# EasyEDA Pro project ProPrj_1111_2025-11-28.epro

# Schematic Schematic1
Board Name: Board1; Create Date: 2025-11-28; Page Name: P1; Project Name: 1111; Schematic Name: Schematic1; Update Date: 2025-11-28; Company: 嘉立创EDA; Page Size: A4; Version: V1.0
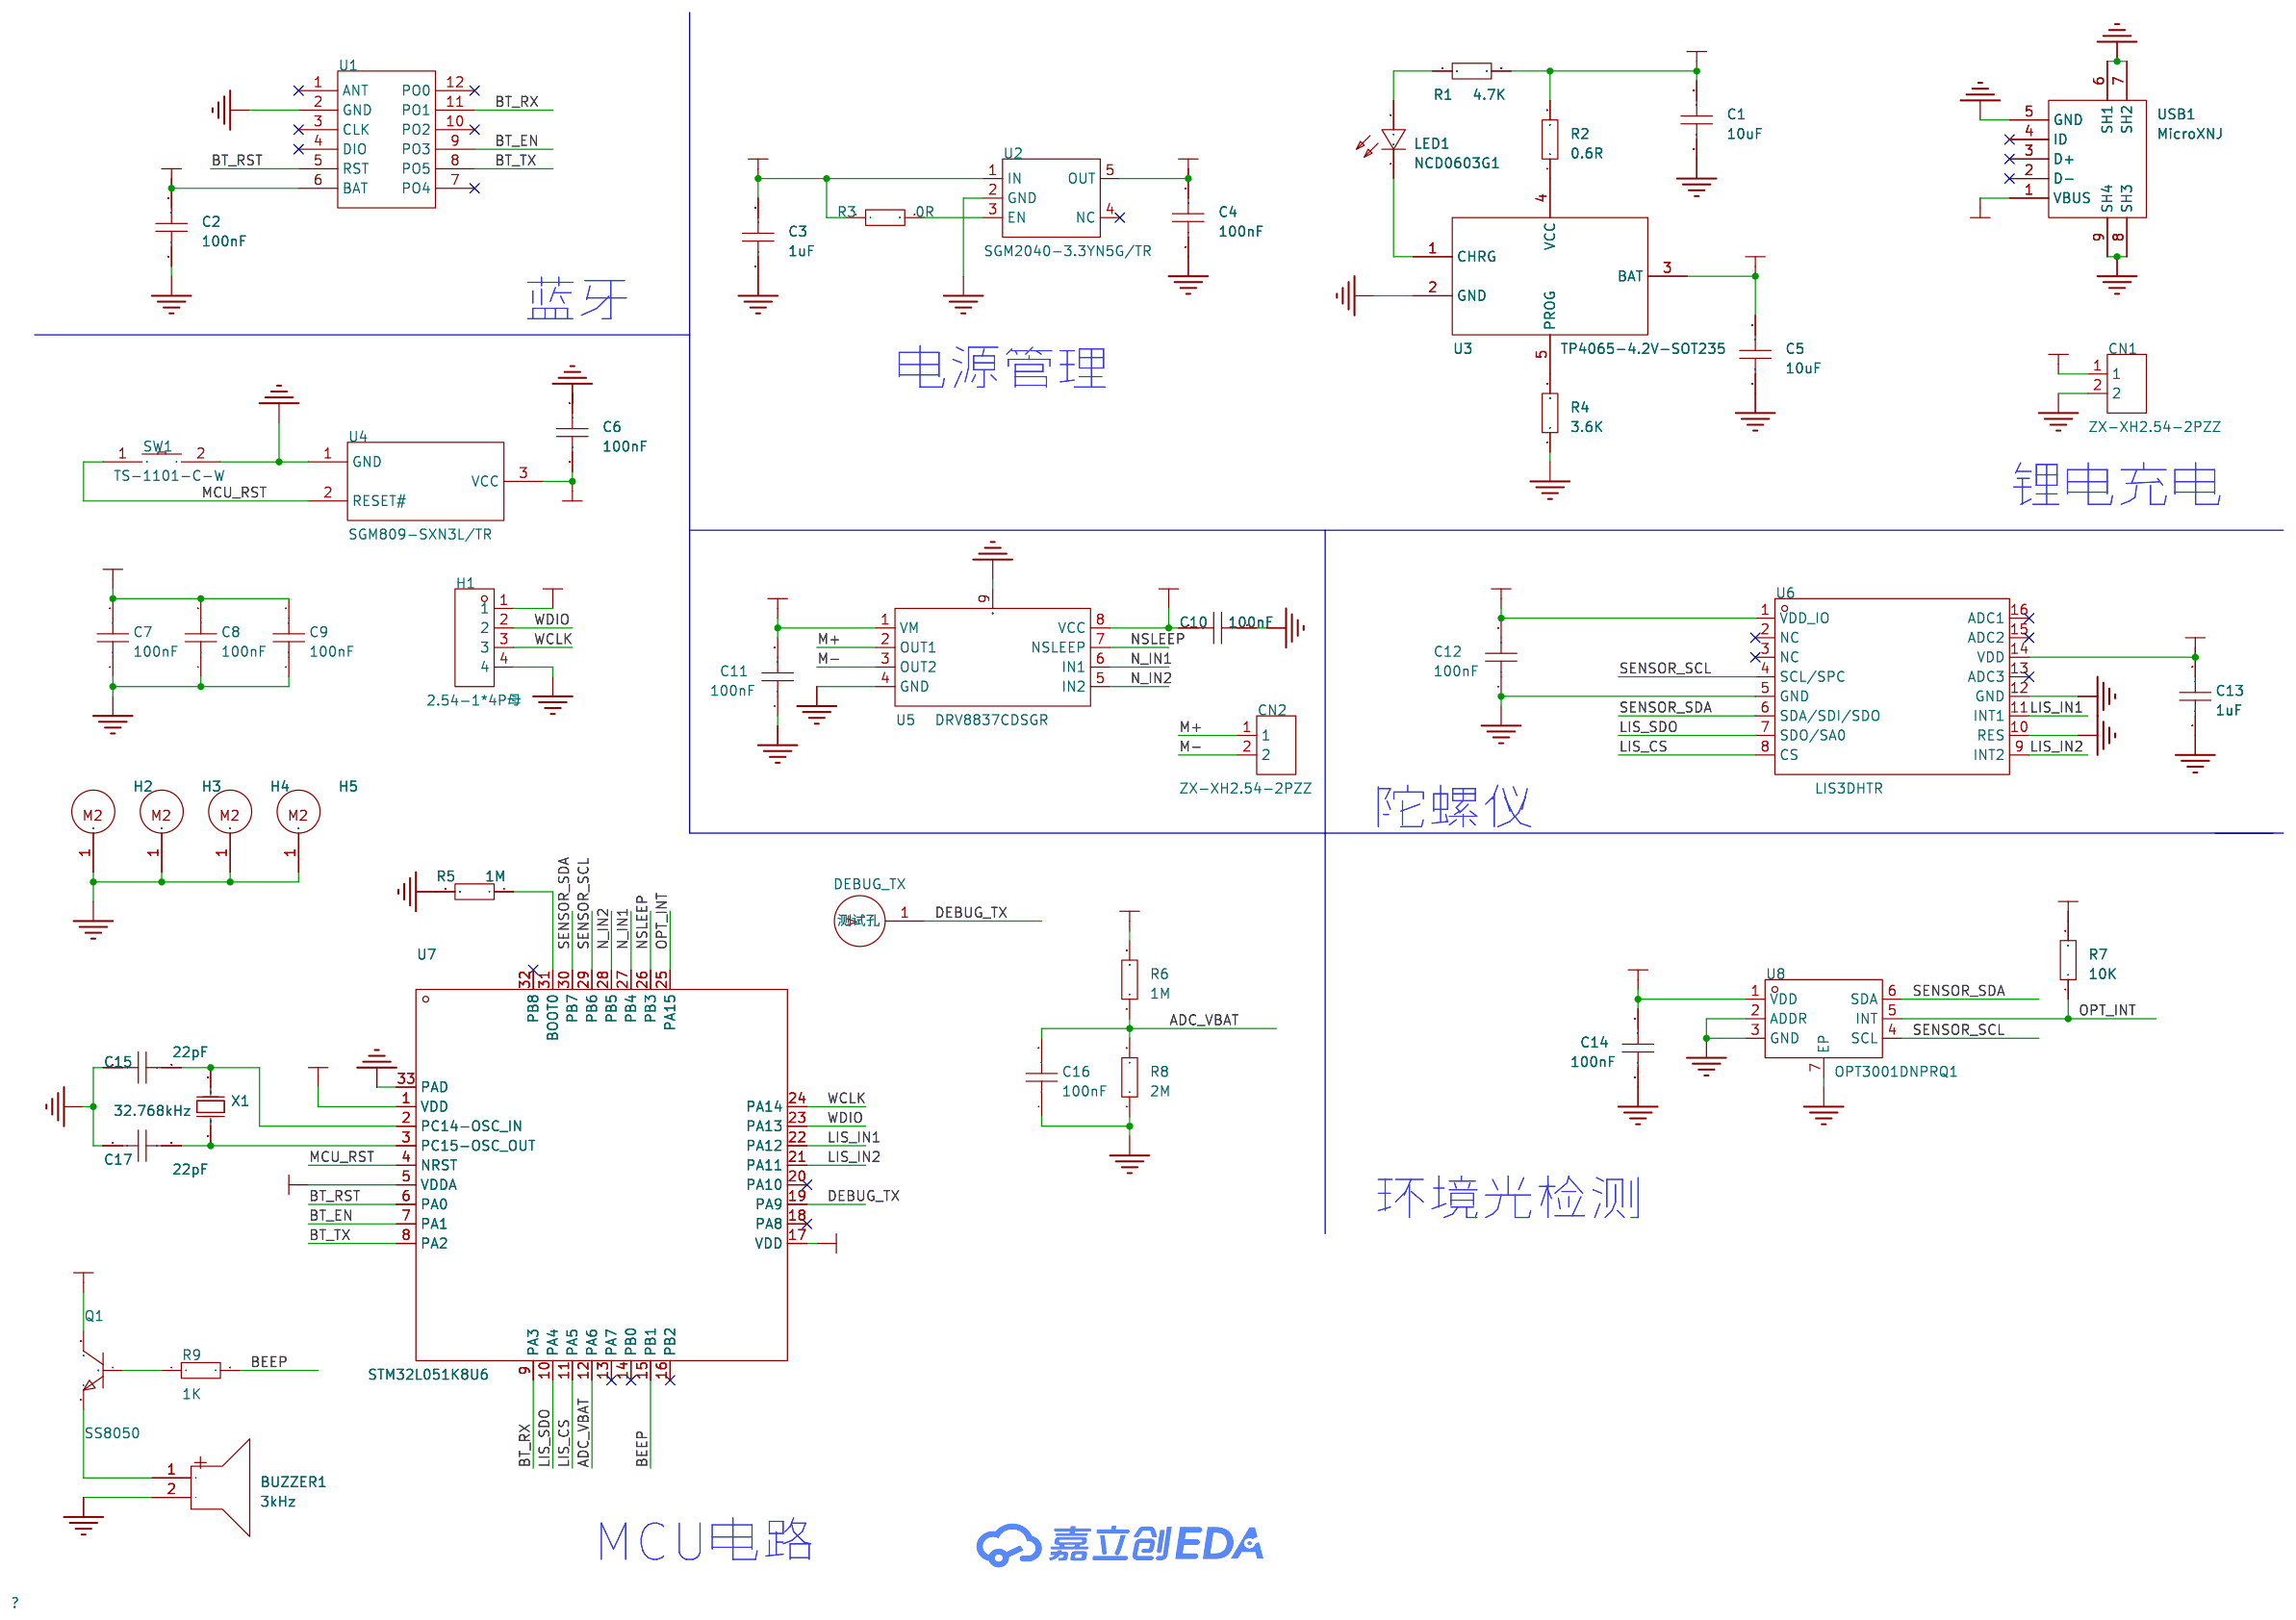
[diagram p0: schematic sheet]

## Parts
BUZZER1  3kHz  [BUZ-TH_BD9.0-P5.00-D0.6-FD]
C1  10uF  [C0603]
C2  100nF  [C0603]
C3  1uF  [C0603]
C4  100nF  [C0603]
C5  10uF  [C0603]
C6  100nF  [C0603]
C7  100nF  [C0603]
C8  100nF  [C0603]
C9  100nF  [C0603]
C10  100nF  [C0603]
C11  100nF  [C0603]
C12  100nF  [C0603]
C13  1uF  [C0603]
C14  100nF  [C0603]
C15  22pF  [C0603]
C16  100nF  [C0603]
C17  22pF  [C0603]
CN1  ZX-XH2.54-2PZZ  [CONN-TH_2P-P2.50_HX25003-2A]
CN2  ZX-XH2.54-2PZZ  [CONN-TH_2P-P2.50_HX25003-2A]
DEBUG_TX  -  [测试孔]
H1  2.54-1*4P母  [HDR-TH_4P-P2.54-V-F]
H2  -  [M2螺丝孔]
H3  -  [M2螺丝孔]
H4  -  [M2螺丝孔]
H5  -  [M2螺丝孔]
LED1  NCD0603G1  [LED0603-RD_1]
Q1  SS8050  [SOT-23_L2.9-W1.3-P1.90-LS2.4-BR]
R1  4.7K  [R0603]
R2  0.6R  [R0603]
R3  0R  [R0603]
R4  3.6K  [R0603]
R5  1M  [R0603]
R6  1M  [R0603]
R7  10K  [R0603]
R8  2M  [R0603]
R9  1K  [R0603]
SW1  TS-1101-C-W  [SW-SMD_L6.0-W3.3-LS8.0]
U1  -  [pw02]
U2  SGM2040-3.3YN5G/TR  [SOT-23-5_L2.9-W1.6-P0.95-LS2.8-BL]
U3  TP4065-4.2V-SOT235  [SOT-23-5_L3.0-W1.7-P0.95-LS2.8-BR]
U4  SGM809-SXN3L/TR  [SOT-23-3_L2.9-W1.6-P1.90-LS2.8-BR]
U5  DRV8837CDSGR  [WSON-8_L2.0-W2.0-P0.50-TL-EP]
U6  LIS3DHTR  [LGA-16_L3.0-W3.0-P0.50-TL]
U7  STM32L051K8U6  [UFQFPN-32_L5.0-W5.0-P0.50-BL-EP]
U8  OPT3001DNPRQ1  [TDFN-6_L2.0-W2.0-P0.65-TL-EP1.4]
USB1  MicroXNJ  [MICRO-USB-SMD_MICROXNJ]
X1  32.768kHz  [CRYSTAL-SMD_L3.2-W1.5-1]

## Library data of the parts
BUZZER1 = HNB09A03: 驱动方式:有源(内含驱动线路);构造类型:电磁式;频率:3kHz;声压(SPL):85dB;; LCSC Part Name: 电磁式有源一体蜂鸣器HNB09A03; Supplier Part: C96102; Manufacturer: 华能; Supplier Footprint: 插件,D=9mm; JLCPCB Part Class: 扩展库; Datasheet: https://item.szlcsc.com/datasheet/HNB09A03/97306.html; Supplier: LCSC; Driver Circuitry: 有源(内含驱动线路); Technology: 电磁式; Voltage - Supply: 1.5V~4.5V; Current Consumption: 30mA; Sound Pressure Level(SPL): 85dB; Diameter(φD): 9mm; Height: 5.5mm; Operating Temperature: -20℃~+70℃
C1-C17 = CAP_0603: Supplier Footprint: 0603
CN1 CN2 = ZX-XH2.54-2PZZ: 插针结构:1x2P;间距:2.5mm;安装方式:直插;参考系列:XH;总PIN数:2P;排数:1;每排PIN数:2;行距:-;额定电流:2A;触头材质:黄铜;触头镀层:锡;工作温度:-25℃~+85℃;; LCSC Part Name: 1x2P 间距:2.5mm 直插 系列:XH; Supplier Part: C7429632; Manufacturer: Megastar(兆星); Supplier Footprint: 插件,P=2.5mm; Datasheet: https://item.szlcsc.com/datasheet/ZX-XH2.54-2PZZ/8427549.html; Supplier: LCSC; Pins Structure: 1x2P; Pitch: 2.5mm; Mounting Type: 直插; Reference Series: XH; Number of Pins: 2P; Number of Rows: 1; Number of PINs Per Row: 2; Current Rating: 2A; Contact Material: 黄铜; Contact Plating: 锡; Operating Temperature: -25℃~+85℃; Voltage Rating: 250V; Plastic Material: PA66; Flame Retardant Rating: UL94V-0; Color: 白色; Z-Height of the Board: 7mm; X-Length of Bottom Edge on Board (Spacing Line): 7.5mm; Y-Width of Bottom Edge on Board: 5.9mm
DEBUG_TX = 测试孔
H1 = 2.54-1*4P母: 插孔结构:1x4P;间距:2.54mm;行距:-;圆孔/方孔:方孔;安装方式:直插;排数:单排;总孔位数:4P;额定电流:3A;额定电压:-;插孔方向:顶部;塑高:-;触头材质:青铜;触头镀层:-;工作温度:-40℃~+105℃;; LCSC Part Name: 间距:2.54mm 1x4P 直插; Supplier Part: C2718488; Manufacturer: BOOMELE(博穆精密); Supplier Footprint: 插件,P=2.54mm; JLCPCB Part Class: 扩展库; Datasheet: https://item.szlcsc.com/datasheet/2.54-1*4P%25E6%25AF%258D/2834502.html; Supplier: LCSC; Holes Structure: 1x4P; Pitch: 2.54mm; Circular Hole / Square Hole: 方孔; Mounting Type: 直插; Number of Rows: 单排; Number of Positions: 4P; Current Rating: 3A; Holes Direction: 顶部; Contact Material: 青铜; Operating Temperature: -40℃~+105℃
H2-H5 = M2螺丝孔
LED1 = NCD0603G1: 发光颜色:翠绿色;正向压降(Vf):2.6V~3.6V;功率:72mW;正向电流:20mA;波长:515nm~530nm;透镜颜色:-;发光强度:330mcd~900mcd;发光角度:130°;工作温度:-30℃~+85℃;; Supplier Part: C84267; Manufacturer: 国星光电; Supplier Footprint: 0603; JLCPCB Part Class: 扩展库; Datasheet: https://item.szlcsc.com/datasheet/NCD0603G1/85436.html; Supplier: LCSC; Illumination Color: 翠绿色; Voltage - Forward(Vf): 2.6V~3.6V; Power(Watts): 72mW; Forward Current: 20mA; Wavelength - Dominant: 515nm~530nm; Luminous Intensity: 330mcd~900mcd; Viewing Angle: 130°; Operating Temperature: -30℃~+85℃
Q1 = SS8050_C431710: 晶体管类型:NPN;集电极电流(Ic):1.5A;集射极击穿电压(Vceo):25V;功率(Pd):300mW;直流电流增益(hFE@Ic,Vce):120@100mA,1V;; LCSC Part Name: NPN 电流:1.5A 耐压:25V (200-350); Supplier Part: C431710; Manufacturer: MDD(辰达半导体); Supplier Footprint: SOT-23; JLCPCB Part Class: 扩展库; Datasheet: https://atta.szlcsc.com/upload/public/pdf/source/20240710/2275D45831FEB988B7478BE0F5F4041C.pdf; Supplier: LCSC; Transistor Type: NPN; Collector Current (Ic): 1.5A; Collector-Emitter Breakdown Voltage (Vceo): 25V; Power Dissipation (Pd): 300mW; DC Current Gain (hFE@Ic,Vce): 120@100mA,1V; Transition Frequency (fT): 100MHz; Collector Cut-Off Current (Icbo): 100nA; Collector-Emitter Saturation Voltage (VCE(sat)@Ic,Ib): 500mV@800mA,80mA; Operating Temperature: -55℃~+150℃
R1-R9 = Res_0603: Supplier Footprint: 0603
SW1 = TS-1101-C-W: 电路结构:单刀单掷;按钮形状:矩形按钮;作用力:260gf;安装方式:立贴;开关长度:6mm;开关宽度:3.6mm;开关高度:2.5mm;带支架:不带;触点电流:50mA;额定电压(AC):-;额定电压(DC):12V;额定功率:-;绝缘电阻:-;带灯:无;机械寿命:5万次;; LCSC Part Name: 6*3.6*2.5mm 立贴 轻触开关; Supplier Part: C318938; Manufacturer: XKB Connectivity(中国星坤); Supplier Footprint: SMD; Datasheet: https://atta.szlcsc.com/upload/public/pdf/source/20200227/C318938_C2E53B1EEDE37D980A33616AC086DE53.pdf; Supplier: LCSC; Circuit: 单刀单掷; Actuator Style: 矩形按钮; Operating Force: 260gf; Mounting Style: 立贴; Switch Length: 6mm; Switch Width: 3.6mm; Switch Height: 2.5mm; Strike Gundam: 不带; Contact Current: 50mA; Voltage Rating (DC): 12V; Actuator/Cap Color: 白色带淡绿; With Lamp: 无; Mechanical Life: 5万次; Operating Temperature: -30℃~+85℃
U1 = pw02
U2 = SGM2040-3.3YN5G/TR: Supplier Part: C2890487; Manufacturer: SGMICRO(圣邦微); Supplier Footprint: SOT-23-5; JLCPCB Part Class: 扩展库; Datasheet: https://atta.szlcsc.com/upload/public/pdf/source/20241203/03403EB46B615BEBA13221F80CD68D6B.pdf; Supplier: LCSC
U3 = TP4065-4.2V-SOT235: 3mA-600mA 线性锂离子电池充电器; Supplier Part: C113540; Manufacturer: TOPPOWER(南京拓微); Supplier Footprint: SOT-23-5; JLCPCB Part Class: 扩展库; Datasheet: https://atta.szlcsc.com/upload/public/pdf/source/20170601/1496302453692.pdf; Supplier: LCSC
U4 = SGM809-SXN3L/TR: 工作电压:1.2V~5.5V;复位有效电平:低电平有效;受监控电压数:1;复位超时:240ms;; Supplier Part: C49651; Manufacturer: SGMICRO(圣邦微); Supplier Footprint: SOT-23; JLCPCB Part Class: 扩展库; Datasheet: https://item.szlcsc.com/datasheet/SGM809-SXN3L%252FTR/50659.html; Supplier: LCSC; ChipType: 电压监控器; Output Type: 推挽; Voltage - Supply: 1.2V~5.5V; Reset Active Level: 低电平有效; Threshold Voltage: 2.93V; Number of Voltages Monitored: 1; Manual Reset: 无; Watchdog: 无; Reset Timeout: 240ms; Operating Temperature: -40℃~+125℃@(Tj); Quiescent Current: 13uA
U5 = DRV8837CDSGR: DRV8837C 12V、1A H 桥电机驱动器; LCSC Part Name: 1A 有刷直流电机驱动芯片 7V; Supplier Part: C191000; Manufacturer: TI(德州仪器); Supplier Footprint: WSON-8-EP(2x2); JLCPCB Part Class: 扩展库; Datasheet: https://www.ti.com/cn/lit/gpn/drv8837c; Supplier: LCSC; RDS(on): 1Ω; Operating Temperature: -40℃~+85℃
U6 = LIS3DHTR: 3轴MEMS加速度计，超低功耗，±2g/±4g/±8g/±16g满量程，高速I2C/SPI数字输出，内置FIFO和高性能加速度传感器，LLGA 16 3x3x1.0封装; Supplier Part: C15134; Manufacturer: ST(意法半导体); Supplier Footprint: LGA-16(3x3); JLCPCB Part Class: 扩展库; Datasheet: https://item.szlcsc.com/datasheet/LIS3DHTR/15808.html; Supplier: LCSC; Voltage - Supply: 1.71V~3.6V; Operating Temperature: -40℃~+85℃
U7 = STM32L051K8U6: CPU内核:ARM-M系列;CPU最大主频:32MHz;应用领域:-;; LCSC Part Name: 基于 ARM Cortex-M0+ 的超低功耗 32 位 MCU，高达 64 KB Flash、8 KB SRAM、2 KB EEPROM、ADC; Supplier Part: C94770; Manufacturer: ST(意法半导体); Supplier Footprint: UFQFPN-32(5x5); JLCPCB Part Class: 扩展库; Datasheet: https://item.szlcsc.com/datasheet/STM32L051K8U6/95970.html; Supplier: LCSC; CPU Core: ARM-M系列; CPU Maximum Speed: 32MHz; Program Storage Size: 64KB; Program Memory Type: FLASH; Number of I/O: 27; ADC (Bit): 12bit; Voltage - Supply: 1.65V~3.6V
U8 = OPT3001DNPRQ1: OPT3001-Q1 具有高精度人眼响应功能的汽车数字环境光传感器 (ALS); Supplier Part: C2876782; Manufacturer: TI(德州仪器); Supplier Footprint: USON-6-EP(2.1x2.1); JLCPCB Part Class: 扩展库; Datasheet: https://www.ti.com/cn/lit/gpn/opt3001-q1; Supplier: LCSC
USB1 = MicroXNJ: 连接器类型:Micro-B;协议标准:USB 2.0;公母:母;安装方式:卧贴;触点数量:5P;端口数量:1;额定电流 - 电源:1.8A;工作温度:-20℃~+85℃;; LCSC Part Name: Micro-B 母 卧贴; Supplier Part: C404969; Manufacturer: SHOU HAN(首韩); Supplier Footprint: SMD; JLCPCB Part Class: 扩展库; Datasheet: https://item.szlcsc.com/datasheet/MicroXNJ/392534.html; Supplier: LCSC; Connector Type: Micro-B; Protocol Standard: USB 2.0; Gender: 母; Mounting Type: 卧贴; Number of Contacts: 5P; Number of Ports: 1; Current Rating-Power: 1.8A; Voltage Rating: 30V; Connect-Disconnect Life: 5千次; Detection color: 黑色; Operating Temperature: -20℃~+85℃
X1 = XKXGI-SUA-32.768K: 晶振类型:贴片晶振;频率:32.768kHz;常温频差:±20ppm;负载电容:12.5pF;频率稳定度:±30ppm;; LCSC Part Name: YST310S 32.768KHZ 2P 3215 12.5PF ±20PPM -40~85℃; Supplier Part: C5213671; Manufacturer: YXC(扬兴晶振); Supplier Footprint: SMD3215-2P; JLCPCB Part Class: 扩展库; Datasheet: https://item.szlcsc.com/datasheet/XKXGI-SUA-32.768K/5908943.html; Supplier: LCSC; Type: 贴片晶振; Normal temperature Frequency Tolerance: ±20ppm; Load Capacitance: 12.5pF; Frequency Stability: ±30ppm; Operating Temperature: -40℃~+85℃

## Nets
GND: BUZZER1.2(-) C1.1 C2.1 C3.1 C4.1 C5.1 C6.1 C7.1 C8.1 C9.1 C10.1 C11.1 C12.1 C13.1 C14.1 C15.1 C16.1 C17.1 CN1.2 H1.4 H2.1 H3.1 H4.1 H5.1 R4.1 R5.2 R8.1 SW1.2 U1.2(GND) U2.2(GND) U3.2(GND) U4.1(GND) U5.4(GND) U5.9(PAD) U6.5(GND) U6.10(RES) U6.12(GND) U7.33(PAD) U8.2(ADDR) U8.3(GND) U8.7(EP) USB1.5(GND) USB1.6(SH1) USB1.7(SH2) USB1.8(SH3) USB1.9(SH4)
VBAT: C3.2 C5.2 C11.2 CN1.1 R3.1 R6.2 U2.1(IN) U3.3(BAT) U5.1(VM)
ADC_VBAT: C16.2 R6.1 R8.2 U7.12(PA6)
BEEP: R9.2 U7.15(PB1)
BT_EN: U1.9(PO3) U7.7(PA1)
BT_RST: U1.5(RST) U7.6(PA0)
BT_RX: U1.11(PO1) U7.9(PA3)
BT_TX: U1.8(PO5) U7.8(PA2)
DC3.3V: C2.2 C4.2 C6.2 C7.2 C8.2 C9.2 C10.2 C12.2 C13.2 C14.2 H1.1 Q1.3(C) R7.2 U1.6(BAT) U2.5(OUT) U4.3(VCC) U5.8(VCC) U6.1(VDD_IO) U6.14(VDD) U7.1(VDD) U7.5(VDDA) U7.17(VDD) U8.1(VDD)
DEBUG_TX: DEBUG_TX.1(测试孔) U7.19(PA9)
LIS_CS: U6.8(CS) U7.11(PA5)
LIS_IN1: U6.11(INT1) U7.22(PA12)
LIS_IN2: U6.9(INT2) U7.21(PA11)
LIS_SDO: U6.7(SDO/SA0) U7.10(PA4)
M+: CN2.1 U5.2(OUT1)
M-: CN2.2 U5.3(OUT2)
MCU_RST: SW1.1 U4.2(RESET#) U7.4(NRST)
N_IN1: U5.6(IN1) U7.27(PB4)
N_IN2: U5.5(IN2) U7.28(PB5)
NSLEEP: U5.7(NSLEEP) U7.26(PB3)
OPT_INT: R7.1 U7.25(PA15) U8.5(INT)
SENSOR_SCL: U6.4(SCL/SPC) U7.29(PB6) U8.4(SCL)
SENSOR_SDA: U6.6(SDA/SDI/SDO) U7.30(PB7) U8.6(SDA)
VUSB: C1.2 R1.1 R2.2 USB1.1(VBUS)
WCLK: H1.3 U7.24(PA14)
WDIO: H1.2 U7.23(PA13)
$1N344: R3.2 U2.3(EN)
$1N805: LED1.1(K) U3.1(CHRG)
$1N852: R4.2 U3.5(PROG)
$1N911: R2.1 U3.4(VCC)
$1N931: LED1.2(A) R1.2
$1N1941: C15.2 U7.2(PC14-OSC_IN) X1.2(OSC2)
$1N1945: C17.2 U7.3(PC15-OSC_OUT) X1.1(OSC1)
$1N2245: R5.1 U7.31(BOOT0)
$1N2484: Q1.1(B) R9.1
$1N2488: BUZZER1.1(+) Q1.2(E)

Not connected (* = marked no-connect by the designer): U1 1(ANT)* 3(CLK)* 4(DIO)* 7(PO4)* 10(PO2)* 12(PO0)*; U2 4(NC)*; U6 2(NC)* 3(NC)* 13(ADC3)* 15(ADC2)* 16(ADC1)*; U7 13(PA7)* 14(PB0)* 16(PB2)* 18(PA8)* 20(PA10)* 32(PB8)*; USB1 2(D-)* 3(D+)* 4(ID)*

## Notes on the sheet
- 蓝牙
- 电源管理
- 锂电充电
- 陀螺仪
- 环境光检测
- MCU电路

# Board PCB1
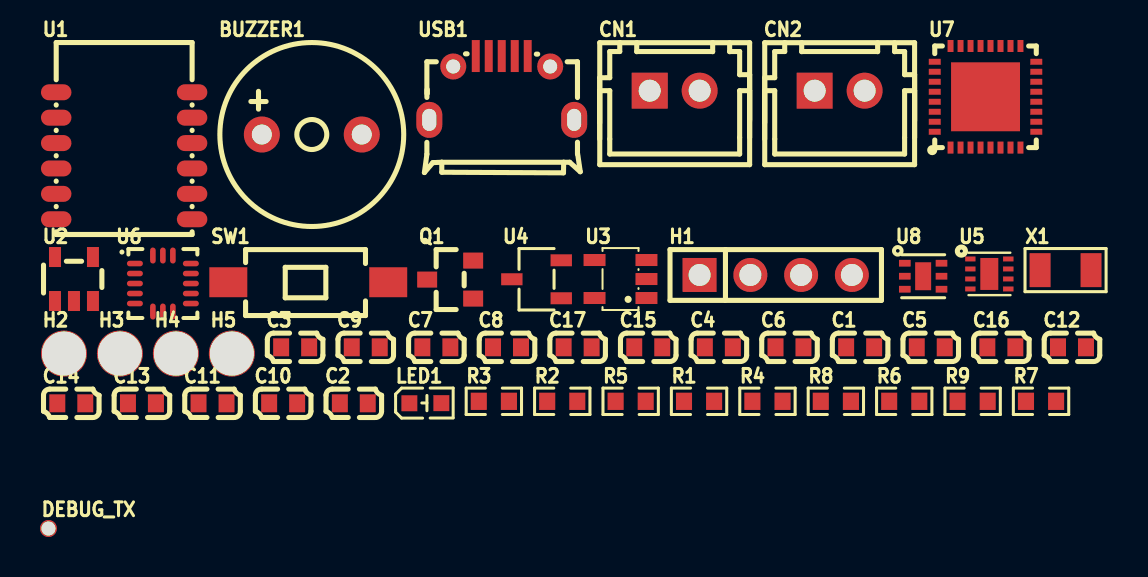
[diagram p1: board, top side]
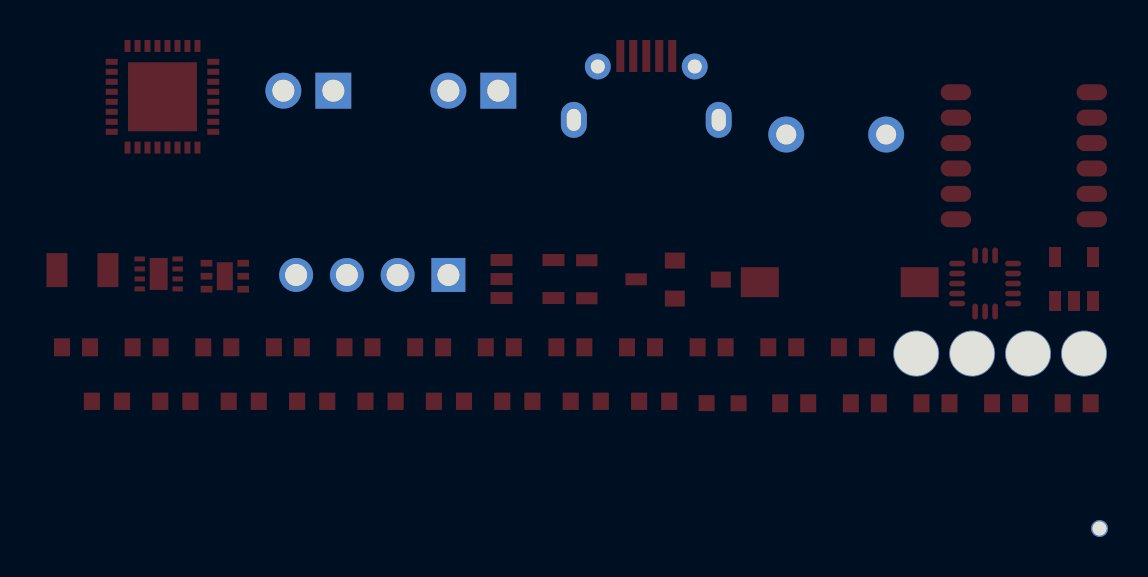
[diagram p2: board, bottom side, seen from below]

No outline. copper layers: Top Layer, Bottom Layer. Coordinates in mm from the lowest, leftmost part position.
Stack: Top Layer 0.035mm / Dielectric1 1.51mm FR4 er 4.5 / Bottom Layer 0.035mm

## Design rules (mm)
template: JLCPCB Capability(Two Layers Board)
spacing copperThickness1oz (default): track to track 0.102, other pairs 0.152 to 0.3
spacing copperThickness2oz: track to track 0.203, other pairs 0.152 to 0.3
track width copperThickness1oz (default): min 0.127, default 0.254, max 2.54
track width copperThickness2oz: min 0.203, default 0.254, max 2.54
differential pair differentialPair (default): width min 0.127, default 0.254, max 2.54; gap min 0.152, default 0.152
via viaSize (default): diameter min 0.5, default 0.61, max 10; hole min 0.3, default 0.305, max 6.3

## Placement (name value [footprint] x y rotation side)
BUZZER1  3kHz  [BUZ-TH_BD9.0-P5.00-D0.6-FD]  13.18 19.66 0 top
C1  10uF  [C0603]  40.62 9.02 0 top
C2  100nF  [C0603]  15.28 6.22 0 top
C3  1uF  [C0603]  12.35 9.02 0 top
C4  100nF  [C0603]  33.55 9.02 0 top
C5  10uF  [C0603]  44.15 9.02 0 top
C6  100nF  [C0603]  37.08 9.02 0 top
C7  100nF  [C0603]  19.41 9.02 0 top
C8  100nF  [C0603]  22.95 9.02 0 top
C9  100nF  [C0603]  15.88 9.02 0 top
C10  100nF  [C0603]  11.75 6.22 0 top
C11  100nF  [C0603]  8.22 6.22 0 top
C12  100nF  [C0603]  51.22 9.02 0 top
C13  1uF  [C0603]  4.68 6.22 0 top
C14  100nF  [C0603]  1.15 6.22 0 top
C15  22pF  [C0603]  30.02 9.02 0 top
C16  100nF  [C0603]  47.69 9.02 0 top
C17  22pF  [C0603]  26.48 9.02 0 top
CN1  ZX-XH2.54-2PZZ  [CONN-TH_2P-P2.50_HX25003-2A]  31.34 21.85 0 top
CN2  ZX-XH2.54-2PZZ  [CONN-TH_2P-P2.50_HX25003-2A]  39.59 21.85 0 top
DEBUG_TX  -  [测试孔]  0 0 0 top
H1  2.54-1*4P母  [HDR-TH_4P-P2.54-V-F]  36.4 12.64 0 top
H2  -  [M2螺丝孔]  0.78 8.71 0 top
H3  -  [M2螺丝孔]  3.58 8.71 0 top
H4  -  [M2螺丝孔]  6.38 8.71 0 top
H5  -  [M2螺丝孔]  9.18 8.71 0 top
LED1  NCD0603G1  [LED0603-RD_1]  18.86 6.22 0 top
Q1  SS8050  [SOT-23_L2.9-W1.3-P1.90-LS2.4-BR]  20.1 12.41 0 top
R1  4.7K  [R0603]  32.56 6.32 0 top
R2  0.6R  [R0603]  25.71 6.32 0 top
R3  0R  [R0603]  22.29 6.32 0 top
R4  3.6K  [R0603]  35.98 6.32 0 top
R5  1M  [R0603]  29.14 6.32 0 top
R6  1M  [R0603]  42.83 6.32 0 top
R7  10K  [R0603]  49.67 6.32 0 top
R8  2M  [R0603]  39.4 6.32 0 top
R9  1K  [R0603]  46.25 6.32 0 top
SW1  TS-1101-C-W  [SW-SMD_L6.0-W3.3-LS8.0]  13 12.27 0 top
U1  -  [pw02]  3.64 19.23 0 top
U2  SGM2040-3.3YN5G/TR  [SOT-23-5_L2.9-W1.6-P0.95-LS2.8-BL]  1.28 12.43 0 top
U3  TP4065-4.2V-SOT235  [SOT-23-5_L3.0-W1.7-P0.95-LS2.8-BR]  28.63 12.43 0 top
U4  SGM809-SXN3L/TR  [SOT-23-3_L2.9-W1.6-P1.90-LS2.8-BR]  24.43 12.42 0 top
U5  DRV8837CDSGR  [WSON-8_L2.0-W2.0-P0.50-TL-EP]  47.08 12.69 0 top
U6  LIS3DHTR  [LGA-16_L3.0-W3.0-P0.50-TL]  5.73 12.21 0 top
U7  STM32L051K8U6  [UFQFPN-32_L5.0-W5.0-P0.50-BL-EP]  46.89 21.55 0 top
U8  OPT3001DNPRQ1  [TDFN-6_L2.0-W2.0-P0.65-TL-EP1.4]  43.77 12.57 0 top
USB1  MicroXNJ  [MICRO-USB-SMD_MICROXNJ]  22.69 21.99 0 top
X1  32.768kHz  [CRYSTAL-SMD_L3.2-W1.5-1]  50.9 12.88 0 top

## Footprints (pads in the part's own frame, mm; a bottom-side part is the same pattern mirrored in y, then rotated)
BUZ-TH_BD9.0-P5.00-D0.6-FD
  round 1.8 hole 1: 1(-2.5,0) 2(2.5,0)
C0603
  rect 0.8x0.9 smd: 1(-0.7,0) 2(0.7,0)
CONN-TH_2P-P2.50_HX25003-2A
  rect 1.8x1.8 hole 1.1: 1(-1.25,0)
  round 1.8 hole 1.1: 2(1.25,0)
CRYSTAL-SMD_L3.2-W1.5-1
  rect 1.05x1.7 smd: 1(-1.275,0) 2(1.275,0)
HDR-TH_4P-P2.54-V-F
  rect 1.7x1.7 hole 1.1: 1(-3.81,0)
  round 1.7 hole 1.1: 2(-1.27,0) 3(1.27,0) 4(3.81,0)
LED0603-RD_1
  rect 0.8x0.8 smd: 1(-0.799,-0.004) 2(0.799,0.004)
LGA-16_L3.0-W3.0-P0.50-TL
  oval 0.8x0.28 smd: 1(-1.4,1) 2(-1.4,0.5) 3(-1.4,0) 4(-1.4,-0.5) 5(-1.4,-1) 9(1.4,-1) 10(1.4,-0.5) 11(1.4,0) 12(1.4,0.5) 13(1.4,1)
  oval 0.28x0.8 smd: 6(-0.5,-1.4) 7(0,-1.4) 8(0.5,-1.4) 14(0.5,1.4) 15(0,1.4) 16(-0.5,1.4)
M2螺丝孔
  round 2.3 hole 2.2: 1(0,0)
MICRO-USB-SMD_MICROXNJ
  rect 0.4x1.6 smd: 1(-1.3,1.597) 2(-0.65,1.597) 3(0,1.597) 4(0.65,1.597) 5(1.3,1.597)
  round 1.3 hole 0.7: 6(2.425,1.074) 9(-2.425,1.073)
  oval 1.3x1.8 hole 0.7x1.1: 7(3.625,-1.597) 8(-3.625,-1.597)
pw02
  oval 1.524x0.8 smd: 1(-3.244,2.54) 2(-3.244,1.27) 3(-3.244,0) 4(-3.244,-1.27) 5(-3.244,-2.54) 6(-3.244,-3.81) 7(3.556,-3.81) 8(3.556,-2.54) 9(3.556,-1.27) 10(3.556,0) 11(3.556,1.27) 12(3.556,2.54)
R0603
  rect 0.806x0.864 smd: 1(-0.753,0) 2(0.753,0)
SOT-23-3_L2.9-W1.6-P1.90-LS2.8-BR
  rect 1.07x0.6 smd: 1(1.235,-0.95) 2(1.235,0.95) 3(-1.235,0)
SOT-23-5_L2.9-W1.6-P0.95-LS2.8-BL
  rect 0.6x1 smd: 1(-0.95,-1.1) 2(0,-1.1) 3(0.95,-1.1) 4(0.95,1.1) 5(-0.95,1.1)
SOT-23-5_L3.0-W1.7-P0.95-LS2.8-BR
  rect 1.1x0.6 smd: 1(1.3,-0.95) 2(1.3,0) 3(1.3,0.95) 4(-1.3,0.95) 5(-1.3,-0.95)
SOT-23_L2.9-W1.3-P1.90-LS2.4-BR
  rect 1x0.8 smd: 1(1.15,-0.95) 2(1.15,0.95) 3(-1.15,0)
SW-SMD_L6.0-W3.3-LS8.0
  rect 1.9x1.5 smd: 1(-4,0) 2(4,0)
TDFN-6_L2.0-W2.0-P0.65-TL-EP1.4
  rect 0.585x0.336 smd: 1(-0.917,0.65) 2(-0.917,0) 3(-0.917,-0.65) 4(0.917,-0.65) 5(0.917,0) 6(0.917,0.65)
  rect 0.8x1.4 smd: 7(0,0)
UFQFPN-32_L5.0-W5.0-P0.50-BL-EP
  rect 0.3x0.6 smd: 1(-1.75,-2.54) 2(-1.25,-2.54) 3(-0.75,-2.54) 4(-0.25,-2.54) 5(0.25,-2.54) 6(0.75,-2.54) 7(1.25,-2.54) 8(1.75,-2.54) 17(1.75,2.54) 18(1.25,2.54) 19(0.75,2.54) 20(0.25,2.54) 21(-0.25,2.54) 22(-0.75,2.54) 23(-1.25,2.54) 24(-1.75,2.54)
  rect 0.6x0.3 smd: 9(2.54,-1.75) 10(2.54,-1.25) 11(2.54,-0.75) 12(2.54,-0.25) 13(2.54,0.25) 14(2.54,0.75) 15(2.54,1.25) 16(2.54,1.75) 25(-2.54,1.75) 26(-2.54,1.25) 27(-2.54,0.75) 28(-2.54,0.25) 29(-2.54,-0.25) 30(-2.54,-0.75) 31(-2.54,-1.25) 32(-2.54,-1.75)
  rect 3.45x3.45 smd: 33(0,0)
WSON-8_L2.0-W2.0-P0.50-TL-EP
  rect 0.521x0.25 smd: 1(-0.95,0.75) 2(-0.95,0.25) 3(-0.95,-0.25) 4(-0.95,-0.75) 5(0.95,-0.75) 6(0.95,-0.25) 7(0.95,0.25) 8(0.95,0.75)
  rect 0.9x1.6 smd: 9(0,0)
测试孔
  round 0.85 hole 0.7: 1(0.004,-0.044)

## Nets
As in the schematic.

Pads without a net: U1 1 3 4 7 10 12; U2 4; U6 2 3 13 15 16; U7 13 14 16 18 20 32; USB1 2 3 4
